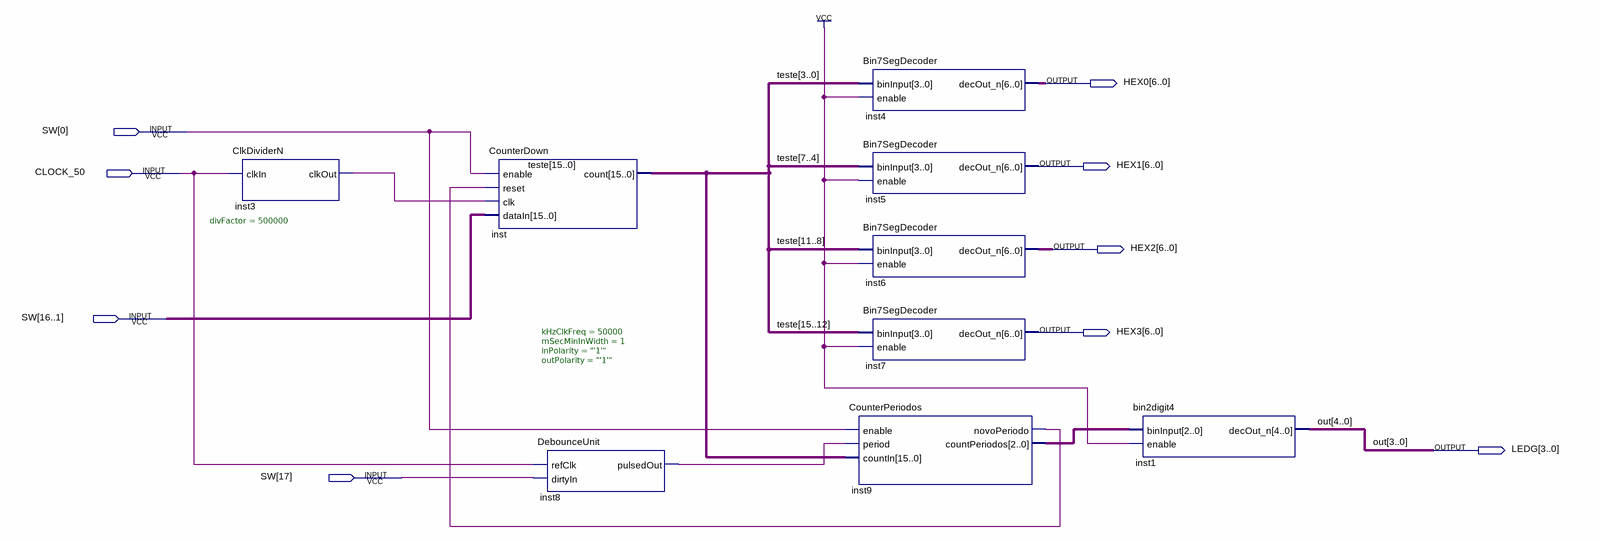
[diagram p0: schematic sheet]
// Quartus schematic Fase1.bdf as structural Verilog: 9 symbols, 9 pins
module Fase1 (
  input  [17:0] SW,
  input  CLOCK_50,
  output [6:0] HEX0,
  output [6:0] HEX1,
  output [6:0] HEX2,
  output [6:0] HEX3,
  output [3:0] LEDG
);

  wire inst3_clkout, inst8_pulsedout, inst9_novoperiodo;
  wire [2:0] inst9_countperiodos;
  wire [4:4] out;
  wire [15:0] teste;

  ClkDividerN #(.divFactor(500000)) inst3 (.clkIn(CLOCK_50), .clkOut(inst3_clkout));
  CounterDown inst (.enable(SW[0]), .reset(inst9_novoperiodo), .clk(inst3_clkout), .dataIn(SW[16:1]), .count(teste));
  DebounceUnit #(.kHzClkFreq(50000), .mSecMinInWidth(1), .inPolarity("'1'"), .outPolarity("'1'")) inst8 (
    .refClk(CLOCK_50), .dirtyIn(SW[17]), .pulsedOut(inst8_pulsedout));
  Bin7SegDecoder inst4 (.binInput(teste[3:0]), .enable(1'b1), .decOut_n(HEX0));
  Bin7SegDecoder inst5 (.binInput(teste[7:4]), .enable(1'b1), .decOut_n(HEX1));
  Bin7SegDecoder inst6 (.binInput(teste[11:8]), .enable(1'b1), .decOut_n(HEX2));
  Bin7SegDecoder inst7 (.binInput(teste[15:12]), .enable(1'b1), .decOut_n(HEX3));
  CounterPeriodos inst9 (
    .enable(SW[0]), .period(inst8_pulsedout), .countIn(teste), .novoPeriodo(inst9_novoperiodo),
    .countPeriodos(inst9_countperiodos));
  bin2digit4 inst1 (.binInput(inst9_countperiodos), .enable(1'b1), .decOut_n({out[4], LEDG}));

  // Other names for the same wires on the sheet: out[3:0] = LEDG
endmodule
